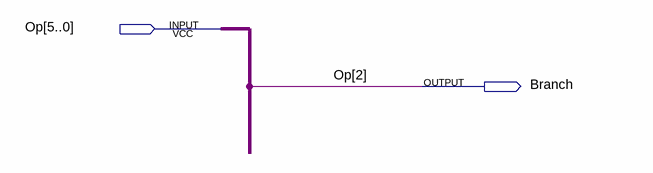
[diagram p0: schematic sheet]
// Quartus schematic BranchDecoder.bdf as structural Verilog: 0 symbols, 2 pins
module BranchDecoder (
  input  [5:0] Op,
  output Branch
);


  assign Branch = Op[2];
endmodule
